# Altium schematic sheet heater.SchDoc: Sensor Heater Control
size A4; SheetNumber: 5; SheetTotal: 6
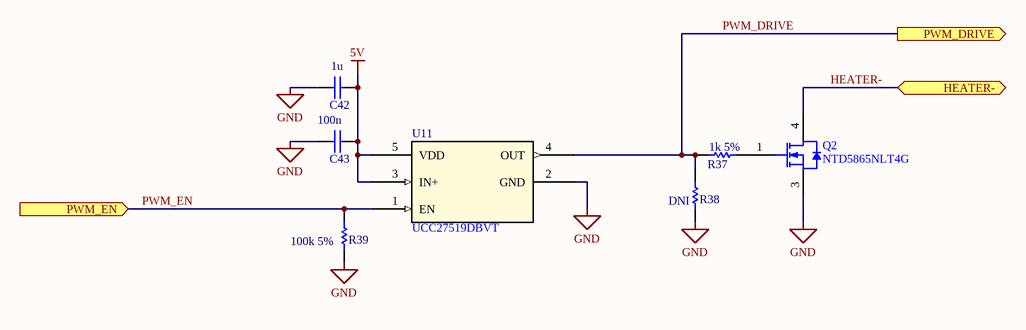
[diagram p0: heater.SchDoc]

## Parts
C42  value 1u  [0805]  (hidden comment: Generic 0805 Capacitor)
C43  value 100n  [0805]  (hidden comment: Generic 0805 Capacitor)
Q2  NTD5865NLT4G  [TO-252AA]
R37  value 1k 5%  [0603]  (hidden comment: Generic 0603 Resistor)
R38  value DNI  [0603]  (hidden comment: Generic 0603 Resistor)
R39  value 100k 5%  [0603]  (hidden comment: Generic 0603 Resistor)
U11  UCC27519DBVT  [DDC0005A_M]

## Ports
HEATER- (bidir), PWM_DRIVE (out), PWM_EN (in)

## Nets
5V: C42.2 C43.2 U11.3(IN+) U11.5(VDD)
GND: C42.1 C43.1 Q2.3(S) R38.1 R39.1 U11.2(GND)
HEATER-: Q2.4(D) ; port HEATER-
PWM_DRIVE: R37.1 R38.2 U11.4(OUT) ; port PWM_DRIVE
PWM_EN: R39.2 U11.1(EN) ; port PWM_EN
NetQ2_1: Q2.1(G) R37.2

## Notes on the sheet
- Title
- Title:
- Project:
- Size:
- Date:
- File:
- E
- Number:
- Time:
- Revision:
- Sheet
- of

## Library data of the parts
C42 C43 = C_0805: Specifications: *
Q2 = NTD5865NL: N-Channel 60V 46A (Tc) 71W (Tc) Surface Mount DPAK
R37-R39 = R_0603: Specifications: *
U11 = UCC27519: Low-Side Gate Driver IC Non-Inverting SOT-23-5